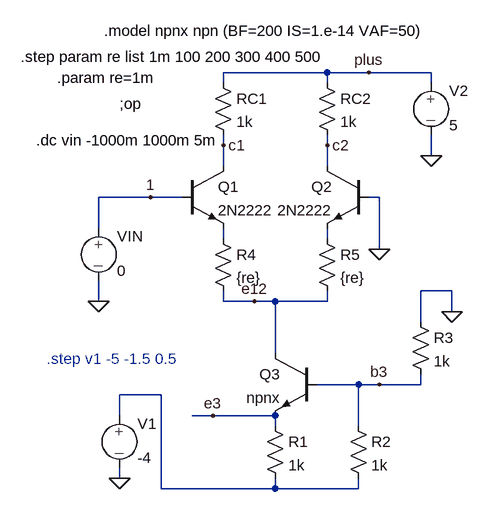
[diagram p0: schematic diff_mit_re.asc]
diff_mit_re.asc, the LTspice schematic file:
Version 4
SHEET 1 880 680
WIRE 352 0 192 0
WIRE 416 0 352 0
WIRE 512 0 416 0
WIRE 192 16 192 0
WIRE 352 16 352 0
WIRE 512 16 512 0
WIRE 192 112 192 96
WIRE 352 112 352 96
WIRE 512 128 512 96
WIRE 192 144 192 112
WIRE 352 144 352 112
WIRE 80 192 0 192
WIRE 128 192 80 192
WIRE 432 192 416 192
WIRE 0 240 0 192
WIRE 192 256 192 240
WIRE 352 256 352 240
WIRE 432 272 432 192
WIRE 544 336 496 336
WIRE 0 352 0 320
WIRE 192 352 192 336
WIRE 240 352 192 352
WIRE 272 352 240 352
WIRE 352 352 352 336
WIRE 352 352 272 352
WIRE 544 368 544 336
WIRE 496 384 496 336
WIRE 272 432 272 352
WIRE 400 480 336 480
WIRE 432 480 400 480
WIRE 496 480 496 464
WIRE 496 480 432 480
WIRE 96 496 32 496
WIRE 32 528 32 496
WIRE 176 528 144 528
WIRE 272 528 176 528
WIRE 272 544 272 528
WIRE 400 544 400 480
WIRE 32 624 32 608
WIRE 96 640 96 496
WIRE 272 640 272 624
WIRE 272 640 96 640
WIRE 400 640 400 624
WIRE 400 640 272 640
FLAG 512 128 0
FLAG 80 192 1
FLAG 240 352 e12
FLAG 352 112 c2
FLAG 192 112 c1
FLAG 416 0 plus
FLAG 432 480 b3
FLAG 176 528 e3
FLAG 0 352 0
FLAG 432 272 0
FLAG 544 368 0
FLAG 32 624 0
SYMBOL EIT_Semiconductors\\npn 128 144 R0
SYMATTR InstName Q1
SYMATTR Value 2N2222
SYMBOL EIT_Semiconductors\\npn 416 144 M0
SYMATTR InstName Q2
SYMATTR Value 2N2222
SYMBOL res 176 0 R0
SYMATTR InstName RC1
SYMATTR Value 1k
SYMBOL res 336 0 R0
SYMATTR InstName RC2
SYMATTR Value 1k
SYMBOL source-V 0 224 R0
SYMATTR InstName VIN
SYMATTR Value 0
SYMBOL source-V 512 0 R0
SYMATTR InstName V2
SYMATTR Value 5
SYMBOL EIT_Semiconductors\\npn 336 432 M0
SYMATTR InstName Q3
SYMATTR Value npnx
SYMBOL res 256 528 R0
SYMATTR InstName R1
SYMATTR Value 1k
SYMBOL res 384 528 R0
SYMATTR InstName R2
SYMATTR Value 1k
SYMBOL res 480 368 R0
SYMATTR InstName R3
SYMATTR Value 1k
SYMBOL source-V 32 512 R0
SYMATTR InstName V1
SYMATTR Value -4
SYMBOL res 176 240 R0
SYMATTR InstName R4
SYMATTR Value {re}
SYMBOL res 336 240 R0
SYMATTR InstName R5
SYMATTR Value {re}
TEXT 32 48 Left 2 !;op
TEXT -96 104 Left 2 !.dc vin -1000m 1000m 5m
TEXT -80 440 Left 2 ;.step v1 -5 -1.5 0.5
TEXT -64 8 Left 2 !.param re=1m
TEXT -120 -24 Left 2 !.step param re list 1m 100 200 300 400 500
TEXT 8 -64 Left 2 !.model npnx npn (BF=200 IS=1.e-14 VAF=50)

The netlist it stands for:
* diff_mit_re.asc
Q1 c1 1 N001 0 2N2222
Q2 c2 0 N002 0 2N2222
RC1 plus c1 1k
RC2 plus c2 1k
VIN 1 0 0
V2 plus 0 5
Q3 e12 b3 e3 0 npnx
R1 e3 N003 1k
R2 b3 N003 1k
R3 0 b3 1k
V1 N003 0 -4
R4 N001 e12 {re}
R5 N002 e12 {re}
.model NPN NPN
.model PNP PNP
.lib standard.bjt
;op
.dc vin -1000m 1000m 5m
* .step v1 -5 -1.5 0.5
.param re=1m
.step param re list 1m 100 200 300 400 500
.model npnx npn (BF=200 IS=1.e-14 VAF=50)
.backanno
.end